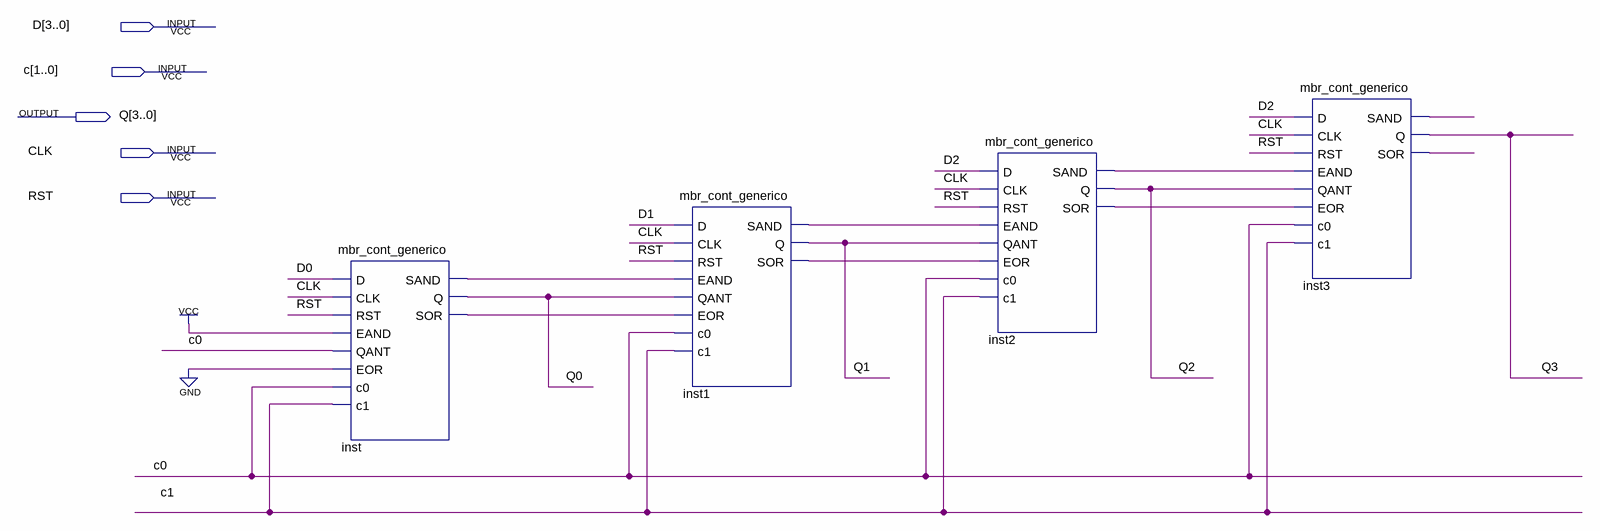
[diagram p0: schematic sheet]
// Quartus schematic mbr_cont_4b.bdf as structural Verilog: 4 symbols, 5 pins
module mbr_cont_4b (
  input  [3:0] D,
  input  [1:0] c,
  input  CLK,
  input  RST,
  output [3:0] Q
);

  wire inst1_sand, inst1_sor, inst2_sand, inst2_sor, inst3_sand, inst3_sor, inst_sand, inst_sor;

  mbr_cont_generico inst (
    .D(D[0]), .CLK(CLK), .RST(RST), .EAND(1'b1), .QANT(c[0]), .EOR(1'b0), .c0(c[0]), .c1(c[1]),
    .SAND(inst_sand), .Q(Q[0]), .SOR(inst_sor));
  mbr_cont_generico inst1 (
    .D(D[1]), .CLK(CLK), .RST(RST), .EAND(inst_sand), .QANT(Q[0]), .EOR(inst_sor), .c0(c[0]), .c1(c[1]),
    .SAND(inst1_sand), .Q(Q[1]), .SOR(inst1_sor));
  mbr_cont_generico inst2 (
    .D(D[2]), .CLK(CLK), .RST(RST), .EAND(inst1_sand), .QANT(Q[1]), .EOR(inst1_sor), .c0(c[0]), .c1(c[1]),
    .SAND(inst2_sand), .Q(Q[2]), .SOR(inst2_sor));
  mbr_cont_generico inst3 (
    .D(D[2]), .CLK(CLK), .RST(RST), .EAND(inst2_sand), .QANT(Q[2]), .EOR(inst2_sor), .c0(c[0]), .c1(c[1]),
    .SAND(inst3_sand), .Q(Q[3]), .SOR(inst3_sor));
endmodule
